# EAGLE design Ears 0603 (EAGLE 6.4)

## Sheet 1 of 3
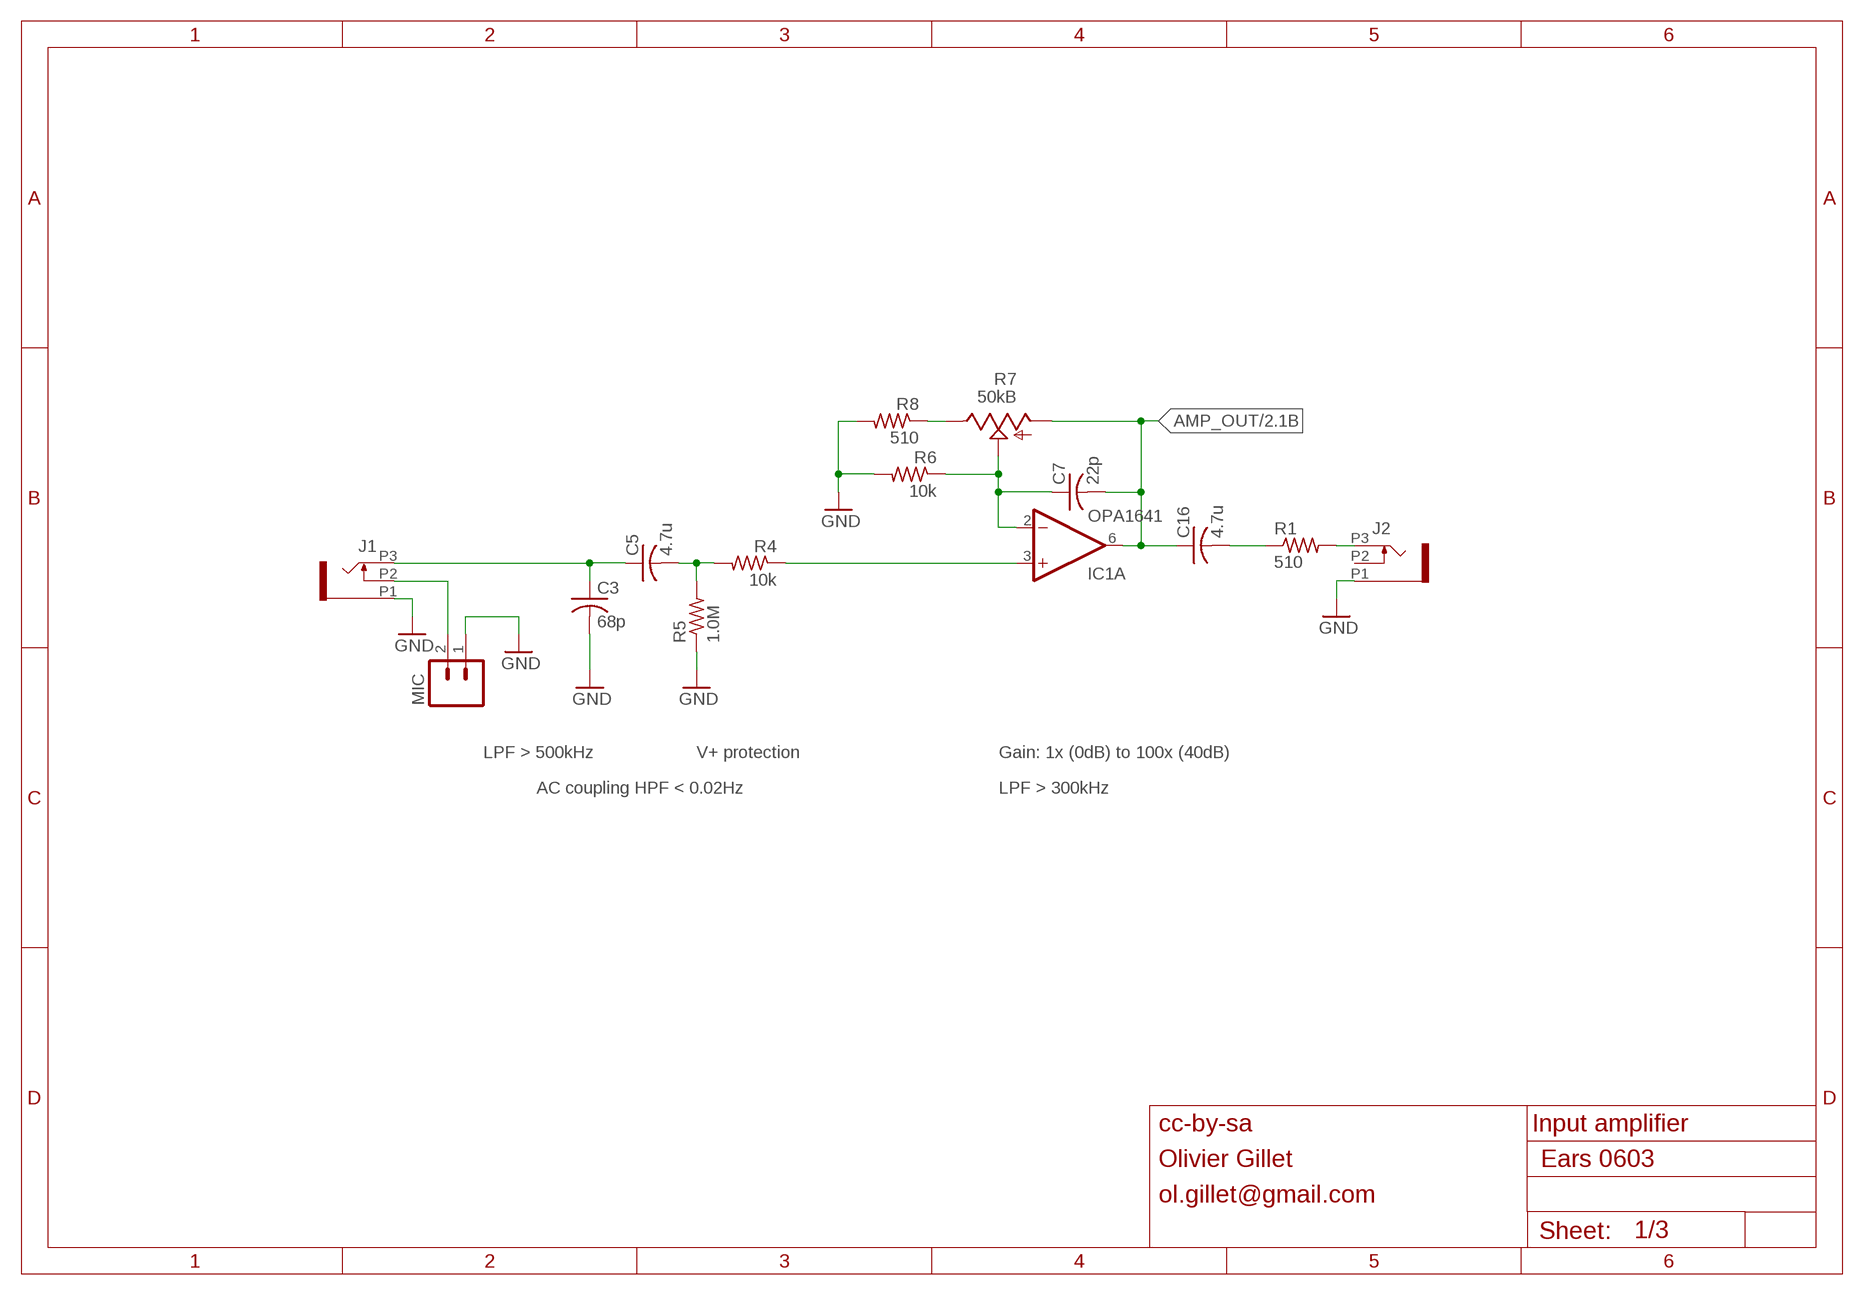
[diagram p0: schematic, sheet 1]

### Parts
C3  68p  C-USC0603  [C0603]
C5  4.7u  C-USC0603  [C0603]
C7  22p  C-USC0603  [C0603]
C16  4.7u  C-USC0603  [C0603]
IC1  OPA1641  [MSOP8]
J1  PJ301_THONKICONN6  [WQP_PJ_301M6]
J2  PJ301_THONKICONN6  [WQP_PJ_301M6]
MIC  M02TINY  [1X02_TINY]
R1  510  R-US_R0603  [R0603]
R4  10k  R-US_R0603  [R0603]
R5  1.0M  R-US_R0603  [R0603]
R6  10k  R-US_R0603  [R0603]
R7  50kB  POT_USVERTICAL_PS  [ALPS_POT_VERTICAL_PS]
R8  510  R-US_R0603  [R0603]

### Nets
AMP_OUT: C7.2 C16.1 IC1.6(A:OUT) R7.P$3(A) ; also sheet 2
GND: C3.2 J1.P1 J2.P1 MIC.1 R5.1 R6.2 R8.2 ; also sheet 2,3
N$2: IC1.3(A:+IN) R4.1
N$3: J2.P3 R1.2
N$4: C3.1 C5.1 J1.P3
N$7: J1.P2 MIC.2
N$9: C7.1 IC1.2(A:-IN) R6.1 R7.P$2(S)
N$10: C5.2 R4.2 R5.2
N$13: R7.P$1(E) R8.1
N$15: C16.2 R1.1
Unconnected: J2.P2

### Notes on the sheet
- LPF > 500kHz | V+ protection | Gain: 1x (0dB) to 100x (40dB)
- AC coupling HPF < 0.02Hz | LPF > 300kHz
- cc-by-sa | Input amplifier
- Olivier Gillet
- ol.gillet@gmail.com

## Sheet 2 of 3
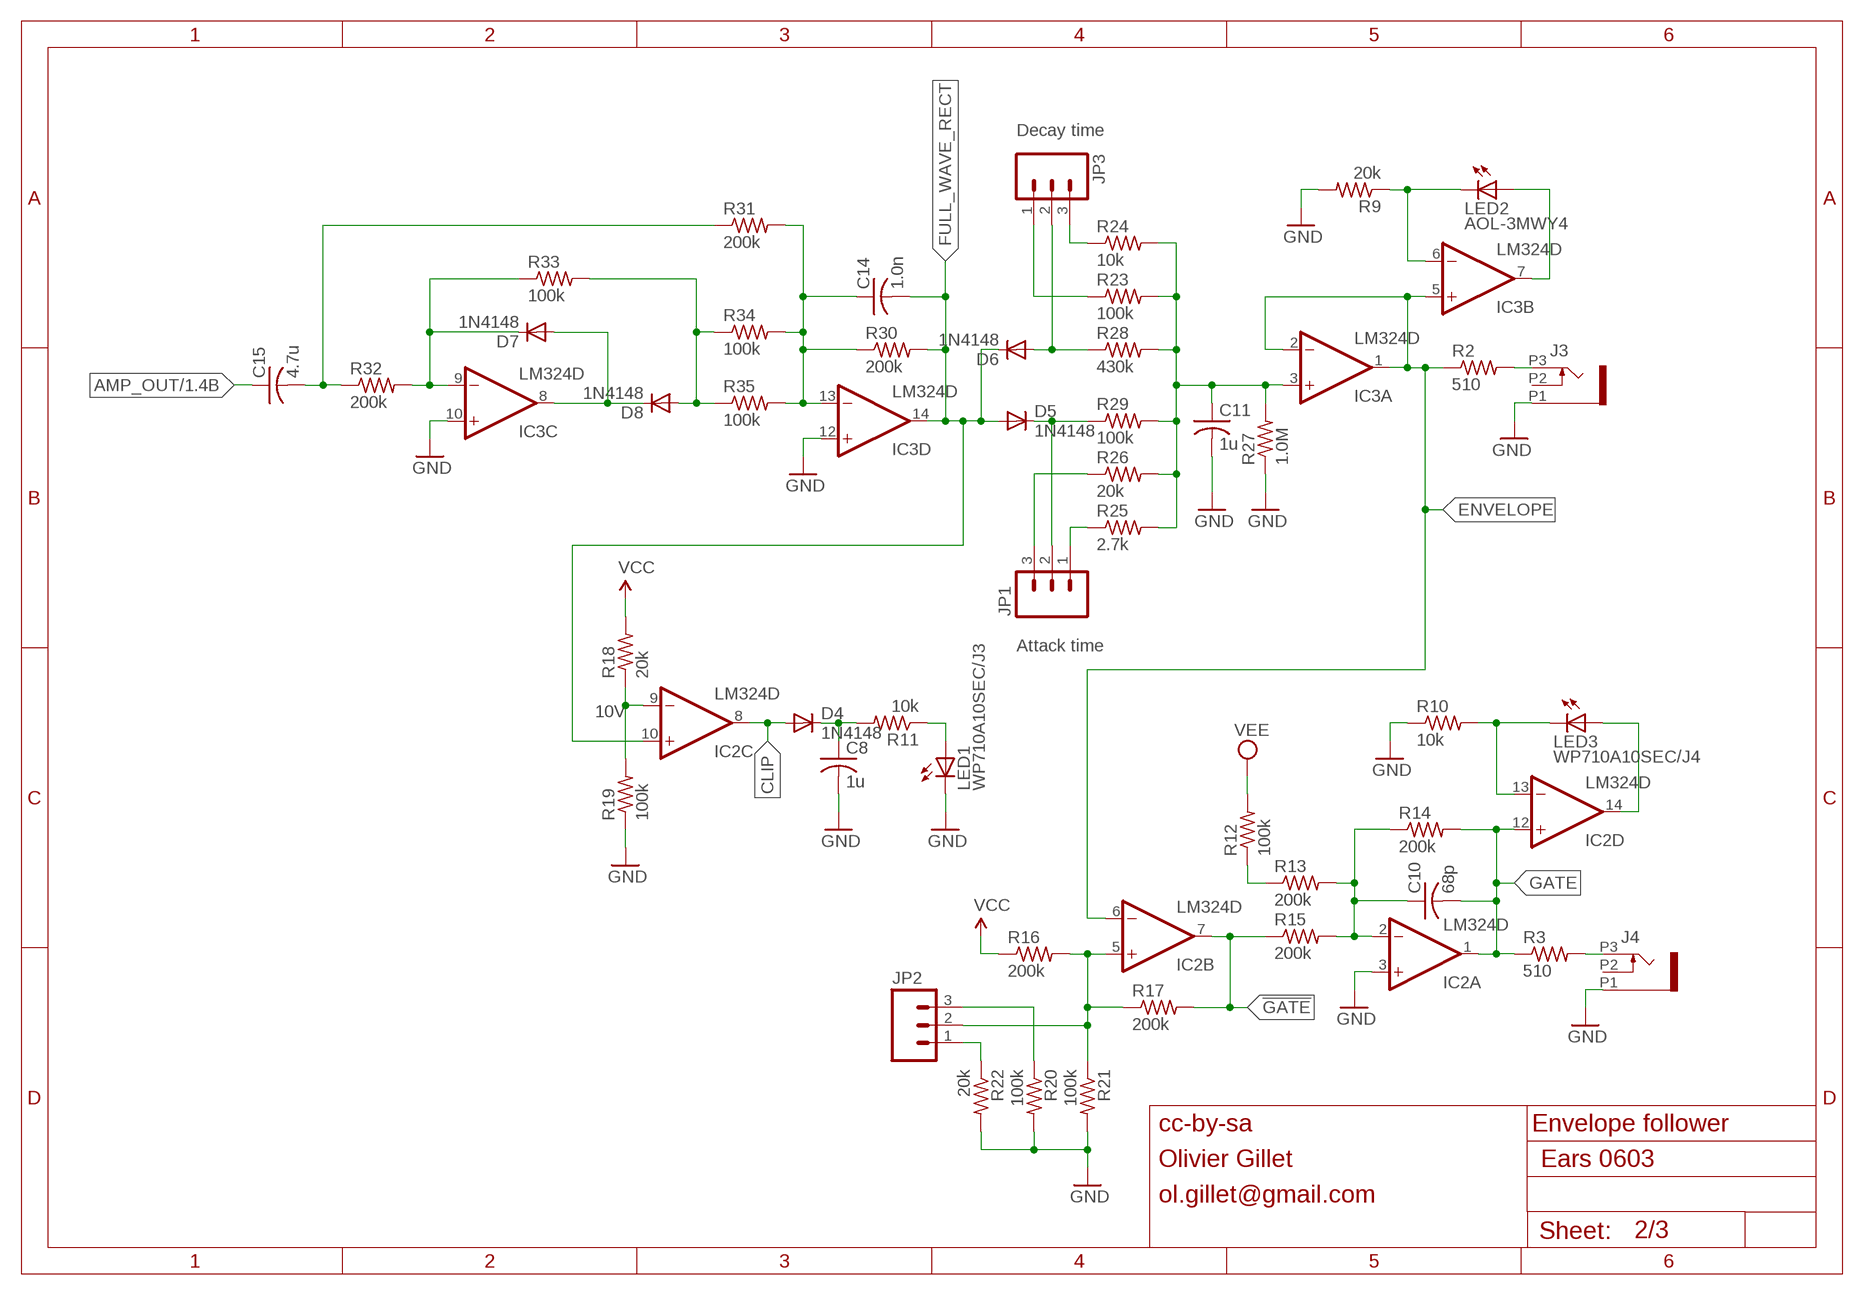
[diagram p1: schematic, sheet 2]

### Parts
C8  1u  C-USC0603  [C0603]
C10  68p  C-USC0603  [C0603]
C11  1u  C-USC0603  [C0603]
C14  1.0n  C-USC0603  [C0603]
C15  4.7u  C-USC0603  [C0603]
D4  1N4148  DIODE-SOD323-W  [SOD323-W]
D5  1N4148  DIODE-SOD323-W  [SOD323-W]
D6  1N4148  DIODE-SOD323-W  [SOD323-W]
D7  1N4148  DIODE-SOD323-W  [SOD323-W]
D8  1N4148  DIODE-SOD323-W  [SOD323-W]
IC2  LM324D  [SO14]
IC3  LM324D  [SO14]
J3  PJ301_THONKICONN6  [WQP_PJ_301M6]
J4  PJ301_THONKICONN6  [WQP_PJ_301M6]
JP1  M03PTH  [1X03]
JP2  M03PTH  [1X03]
JP3  M03PTH  [1X03]
LED1  WP710A10SEC/J3  LED3MM  [LED3MM]
LED2  AOL-3MWY4  LED3MM  [LED3MM]
LED3  WP710A10SEC/J4  LED3MM  [LED3MM]
R2  510  R-US_R0603  [R0603]
R3  510  R-US_R0603  [R0603]
R9  20k  R-US_R0603  [R0603]
R10  10k  R-US_R0603  [R0603]
R11  10k  R-US_R0603  [R0603]
R12  100k  R-US_R0603  [R0603]
R13  200k  R-US_R0603  [R0603]
R14  200k  R-US_R0603  [R0603]
R15  200k  R-US_R0603  [R0603]
R16  200k  R-US_R0603  [R0603]
R17  200k  R-US_R0603  [R0603]
R18  20k  R-US_R0603  [R0603]
R19  100k  R-US_R0603  [R0603]
R20  100k  R-US_R0603  [R0603]
R21  100k  R-US_R0603  [R0603]
R22  20k  R-US_R0603  [R0603]
R23  100k  R-US_R0603  [R0603]
R24  10k  R-US_R0603  [R0603]
R25  2.7k  R-US_R0603  [R0603]
R26  20k  R-US_R0603  [R0603]
R27  1.0M  R-US_R0603  [R0603]
R28  430k  R-US_R0603  [R0603]
R29  100k  R-US_R0603  [R0603]
R30  200k  R-US_R0603  [R0603]
R31  200k  R-US_R0603  [R0603]
R32  200k  R-US_R0603  [R0603]
R33  100k  R-US_R0603  [R0603]
R34  100k  R-US_R0603  [R0603]
R35  100k  R-US_R0603  [R0603]

### Nets
!GATE: IC2.7(B:OUT) R15.1 R17.2
AMP_OUT: C15.1 ; also sheet 1
AMP_OUT_AC: C15.2 R31.1 R32.1
CLIP: D4.A IC2.8(C:OUT)
ENVELOPE: IC2.6(B:-IN) IC3.1(A:OUT) IC3.2(A:-IN) IC3.5(B:+IN) R2.1
FULL_WAVE_RECT: C14.2 D5.A D6.C IC2.10(C:+IN) IC3.14(D:OUT) R30.2
GATE: C10.2 IC2.1(A:OUT) IC2.12(D:+IN) R3.1 R14.2
GND: C8.2 C11.2 IC2.3(A:+IN) IC3.10(C:+IN) IC3.12(D:+IN) J3.P1 J4.P1 LED1.K(C) R9.2 R10.1 R19.1 R20.2 R21.2 R22.2 R27.1 ; also sheet 1,3
N$5: D7.A D8.C IC3.8(C:OUT)
N$8: C10.1 IC2.2(A:-IN) R13.2 R14.1 R15.2
N$11: D7.C IC3.9(C:-IN) R32.2 R33.1
N$12: D8.A R33.2 R34.1 R35.1
N$14: C14.1 IC3.13(D:-IN) R30.1 R31.2 R34.2 R35.2
N$16: J3.P3 R2.2
N$17: IC3.6(B:-IN) LED2.K(C) R9.1
N$18: D5.C JP1.2 R29.1
N$19: C11.1 IC3.3(A:+IN) R23.2 R24.2 R25.2 R26.2 R27.2 R28.2 R29.2
N$21: JP3.3 R24.1
N$23: JP3.1 R23.1
N$24: D6.A JP3.2 R28.1
N$25: JP1.1 R25.1
N$26: JP1.3 R26.1
N$27: IC2.9(C:-IN) R18.1 R19.2
N$28: C8.1 D4.C R11.2
N$30: IC3.7(B:OUT) LED2.A
N$31: LED1.A R11.1
N$32: J4.P3 R3.2
N$33: IC2.5(B:+IN) JP2.2 R16.2 R17.1 R21.1
N$35: JP2.1 R22.1
N$36: JP2.3 R20.1
N$37: IC2.13(D:-IN) LED3.K(C) R10.2
N$38: IC2.14(D:OUT) LED3.A
N$39: R12.1 R13.1
VCC: R16.1 R18.2 ; also sheet 3
VEE: R12.2 ; also sheet 3
Unconnected: J3.P2 J4.P2

### Notes on the sheet
- Decay time
- Attack time
- 10V
- cc-by-sa | Envelope follower
- Olivier Gillet
- ol.gillet@gmail.com

## Sheet 3 of 3
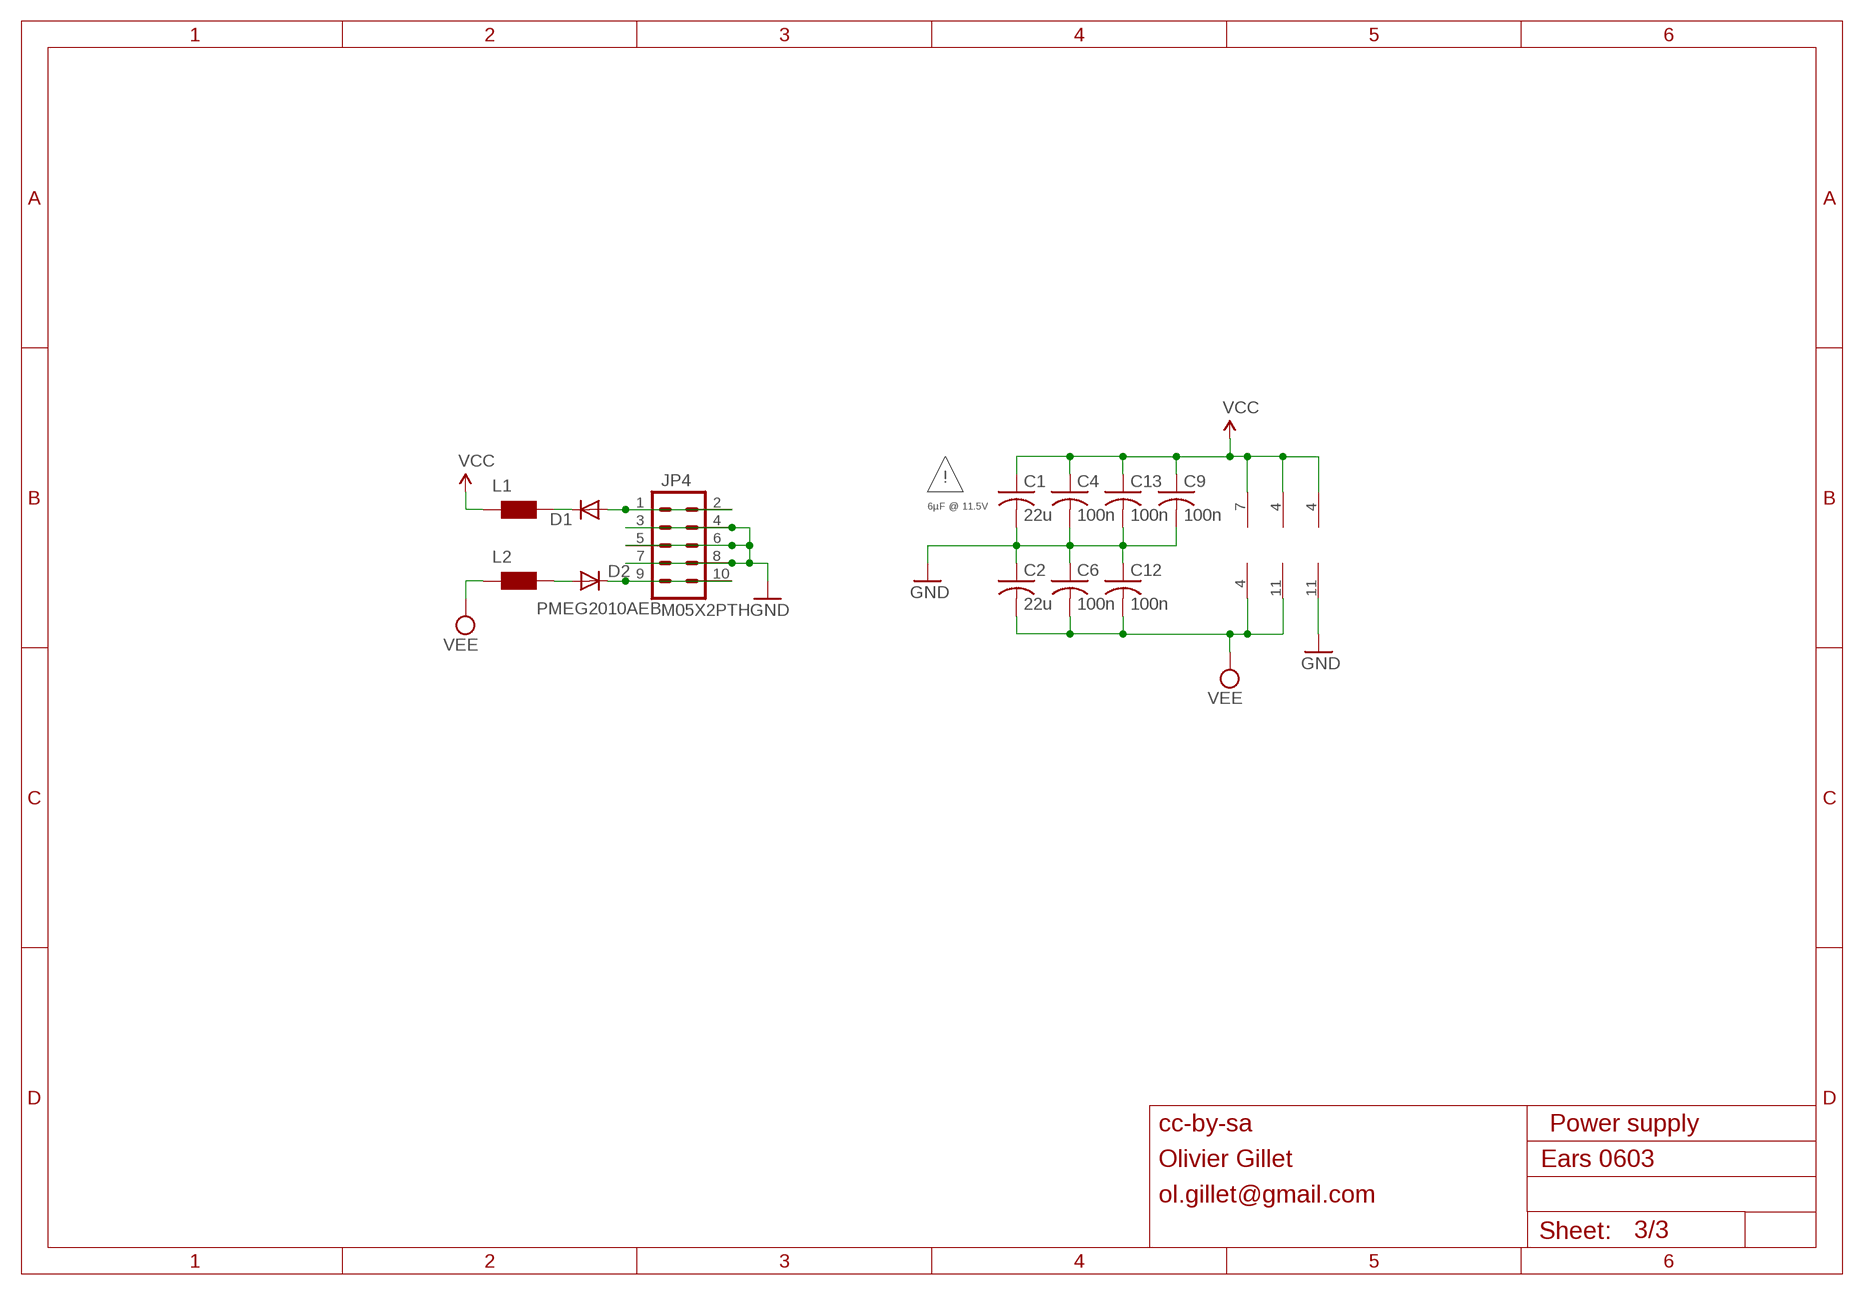
[diagram p2: schematic, sheet 3]

### Parts
C1  22u  C-USC1206  [C1206]
C2  22u  C-USC1206  [C1206]
C4  100n  C-USC0603  [C0603]
C6  100n  C-USC0603  [C0603]
C9  100n  C-USC0603  [C0603]
C12  100n  C-USC0603  [C0603]
C13  100n  C-USC0603  [C0603]
D1  PMEG2010AEB  DIODE-SOD323-W  [SOD323-W]
D2  PMEG2010AEB  DIODE-SOD323-W  [SOD323-W]
JP4  M05X2PTH  [AVR_ICSP]
L1  WE-CBF_0603  [0603]
L2  WE-CBF_0603  [0603]

### Nets
GND: C1.2 C2.1 C4.2 C6.1 C9.2 C12.1 C13.2 IC2.11(P:V-) JP4.3 JP4.4 JP4.5 JP4.6 JP4.7 JP4.8 ; also sheet 1,2
N$6: D1.A JP4.1 JP4.2
N$20: D2.C JP4.9 JP4.10
N$22: D1.C L1.2
N$44: D2.A L2.2
VCC: C1.1 C4.1 C9.1 C13.1 IC1.7(V+) IC2.4(P:V+) IC3.4(P:V+) L1.1 ; also sheet 2
VEE: C2.2 C6.2 C12.2 IC1.4(V-) IC3.11(P:V-) L2.1 ; also sheet 2

### Notes on the sheet
- !
- 6µF @ 11.5V
- cc-by-sa | Power supply
- Olivier Gillet
- ol.gillet@gmail.com

## Library data of the parts
C1-C16 = rcl:C-US: CAPACITOR, American symbol
D1 D2 D4-D8 = diode:DIODE-: DIODE
IC1 = og-ics:OPA1641
IC2 IC3 = og-ics:LM324: OP AMP
J1-J4 = og-pj301:PJ301_THONKICONN
JP1-JP3 = SparkFun:M03: Header 3 Standard 3-pin 0.1" header. Use with straight break away headers (SKU : PRT-00116), right angle break away headers (PRT-00553), swiss pins (PRT-00743), machine pins (PRT-00117), and female headers (PRT-00115). Molex polarized connector foot print use with SKU : PRT-08232 with associated crimp pins and housings.
JP4 = og-header:M05X2: Header 5x2 Standard 10-pin dual row 0.1" header. Commonly used with AVR-ISP. Use with Spark Fun Electronics SKU: PRT-00778
L1 L2 = wuerth-elektronik:WE-CBF: SMD EMI Suppression Ferrite Beads - excellent anti-EMI properties - low DCR - impedances till 3000 ohms - rated current up to 6 A
LED1-LED3 = led:LED: LED OSRAM: - CHIPLED LG R971, LG N971, LY N971, LG Q971, LY Q971, LO R971, LY R971 LH N974, LH R974 LS Q976, LO Q976, LY Q976 LO Q996 - Hyper CHIPLED LW Q18S LB Q993, LB Q99A, LB R99A - SideLED LS A670, LO A670, LY A670, LG A670, LP A670 LB A673, LV A673, LT A673, LW A673 LH A674 LY A675 LS A676, LA A676, LO A676, LY A676, LW A676 LS A679, LY A679, LG A679 - Hyper Micro SIDELED® LS Y876, LA Y876, LO Y876, LY Y876 LT Y87S - SmartLED LW L88C, LW L88S LB L89C, LB L89S, LG L890 LS L89K, LO L89K, LY L89K LS L896, LA L896, LO L896, LY L896 - TOPLED LS T670, LO T670, LY T670, LG T670, LP T670 LSG T670, LSP T670, LSY T670, LOP T670, LYG T670 LG T671, LOG T671, LSG T671 LB T673, LV T673, LT T673, LW T673 LH T674 LS T676, LA T676, LO T676, LY T676, LB T676, LH T676, LSB T676, LW T676 LB T67C, LV T67C, LT T67C, LS T67K, LO T67K, LY T67K, LW E67C LS E67B, LA E67B, LO E67B, LY E67B, LB E67C, LV E67C, LT E67C LW T67C LS T679, LY T679, LG T679 LS T770, LO T770, LY T770, LG T770, LP T770 LB T773, LV T773, LT T773, LW T773 LH T774 LS E675, LA E675, LY E675, LS T675 LS T776, LA T776, LO T776, LY T776, LB T776 LHGB T686 LT T68C, LB T68C - Hyper Mini TOPLED® LB M676 - Mini TOPLED Santana® LG M470 LS M47K, LO M47K, LY M47K Source: http://www.osram.convergy.de LUXEON: - LUMILED® LXK2-PW12-R00, LXK2-PW12-S00, LXK2-PW14-U00, LXK2-PW14-V00 LXK2-PM12-R00, LXK2-PM12-S00, LXK2-PM14-U00 LXK2-PE12-Q00, LXK2-PE12-R00, LXK2-PE12-S00, LXK2-PE14-T00, LXK2-PE14-U00 LXK2-PB12-K00, LXK2-PB12-L00, LXK2-PB12-M00, LXK2-PB14-N00, LXK2-PB14-P00, LXK2-PB14-Q00 LXK2-PR12-L00, LXK2-PR12-M00, LXK2-PR14-Q00, LXK2-PR14-R00 LXK2-PD12-Q00, LXK2-PD12-R00, LXK2-PD12-S00 LXK2-PH12-R00, LXK2-PH12-S00 LXK2-PL12-P00, LXK2-PL12-Q00, LXK2-PL12-R00 Source: www.luxeon.com KINGBRIGHT: KA-3528ASYC Source: www.kingbright.com
MIC = og-header:M02: Header 2 Standard 2-pin 0.1" header. Use with straight break away headers (SKU : PRT-00116), right angle break away headers (PRT-00553), swiss pins (PRT-00743), machine pins (PRT-00117), and female headers (PRT-00115). Molex polarized connector foot print use with SKU : PRT-08233 with associated crimp pins and housings.
R1-R6 R8-R35 = rcl:R-US_: RESISTOR, American symbol
R7 = og-pots:POT_US

## Board
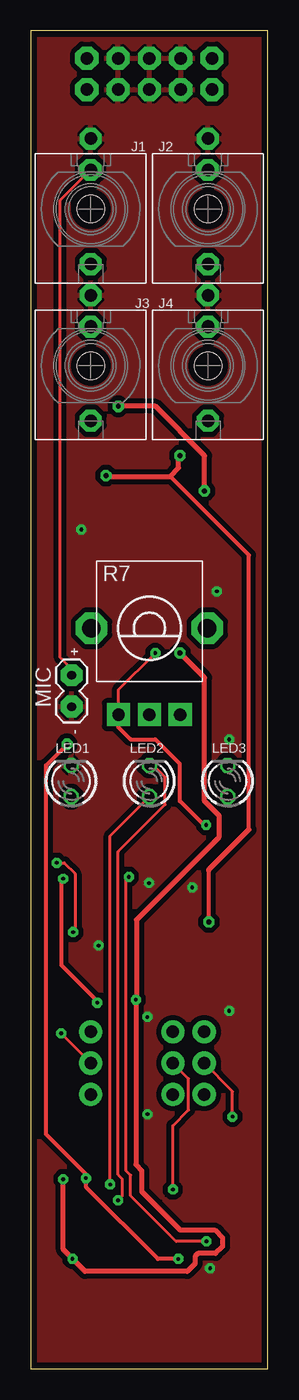
[diagram p3: board, top side]
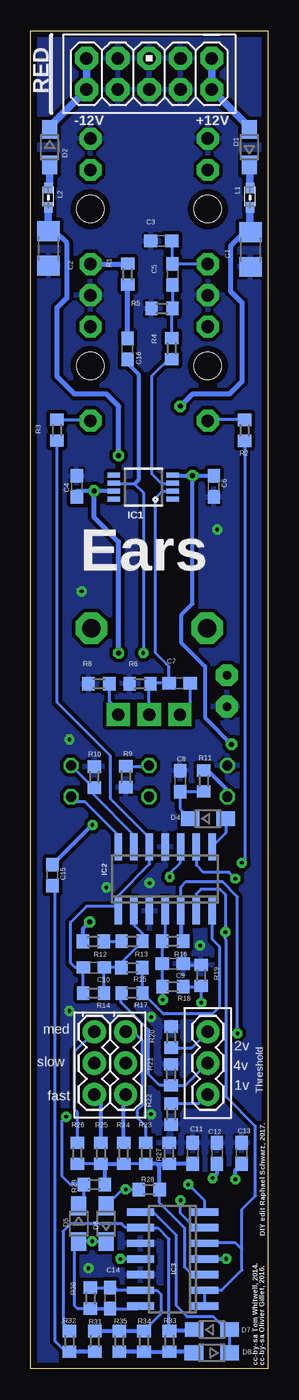
[diagram p4: board, bottom side, seen from below]

Size 19.23 x 108.43 mm. Coordinates in mm from the lower left corner, seen from the top.
Outline: 0,0 19.23,0 19.23,108.43 0,108.43 0,0
Copper layers (1*16): Top 0.035mm / dielectric 1.5mm / Bottom 0.035mm
Design rules "PCBCart-Standard *": minimum track width 8mil, minimum drill 0.4mm, track to track 8mil, track to pad 8mil, pad to pad 8mil, via to via 8mil, smd to smd 8mil, copper to edge 20mil, drill to drill 8mil, minimum pad ring 8mil, minimum via ring 10mil, stop-mask expansion 3mil, vias tented up to drill 25mil, thermal gap 8mil

### Footprints (pad centres in the part's own frame; a part is rotated, then mirrored left to right if it is on the bottom)
C1206 = smd 1.6 x 1.8: 1 -1.4,0; 2 1.4,0
C0603 = smd 1.1 x 1: 1 -0.85,0; 2 0.85,0
SOD323-W = smd 1.5 x 1.2: A 1.45,0; C -1.45,0
MSOP8 = smd 0.41 x 1.02: 1 -0.975,-2.4; 2 -0.325,-2.4; 3 0.325,-2.4; 4 0.975,-2.4; 5 0.975,2.4; 6 0.325,2.4; 7 -0.325,2.4; 8 -0.975,2.4
SO14 = smd 0.6 x 2.2: 1 -3.81,-2.6; 2 -2.54,-2.6; 3 -1.27,-2.6; 4 0,-2.6; 5 1.27,-2.6; 6 2.54,-2.6; 7 3.81,-2.6; 8 3.81,2.6; 9 2.54,2.6; 10 1.27,2.6; 11 0,2.6; 12 -1.27,2.6; 13 -2.54,2.6; 14 -3.81,2.6
WQP_PJ_301M6 = drill 1.016 pad 1.778 octagon: P1 0,-5.715; P2 0,-3.175; P3 0,4.445 | hole 2.2: 0,0
1X03 = drill 1.016 pad 1.88: 1 0,0; 2 2.54,0; 3 5.08,0
AVR_ICSP = drill 1.016 pad 1.88 octagon: 1 -1.27,5.08; 2 1.27,5.08; 3 -1.27,2.54; 4 1.27,2.54; 5 -1.27,0; 6 1.27,0; 7 -1.27,-2.54; 8 1.27,-2.54; 9 -1.27,-5.08; 10 1.27,-5.08
0603 = smd 0.85 x 0.7: 1 -0.9,0; 2 0.7,0
LED3MM = drill 0.813 octagon: A -1.27,0; K 1.27,0
1X02_TINY = drill 0.7 pad 1.778 octagon: 1 0,0; 2 2.54,0
R0603 = smd 1 x 1.1: 1 -0.85,0; 2 0.85,0
ALPS_POT_VERTICAL_PS = drill 1 pad 1.88 square: P$1 -2.5,7; P$2 0,7; P$3 2.5,7 | drill 1.5 pad 2.54 octagon: P$4 -4.7,0; P$5 4.7,0

### Placement (x,y rotation side)
C1  1.4,90.7 270 bottom
C2  17.8,90.8 90 bottom
C3  8.63,91.39 180 bottom
C4  15.5,71.5 90 bottom
C5  7.73,88.7 270 bottom
C6  4.37,71.5 90 bottom
C7  7.15,55.56 0 bottom
C8  7.11,47.62 90 bottom
C9  7.71,32.82 0 bottom
C10  14.13,32.52 180 bottom
C11  6.08,17.45 90 bottom
C12  4.13,17.45 270 bottom
C13  2.13,17.45 90 bottom
C14  12.8,5.71 270 bottom
C15  17.46,40.01 270 bottom
C16  11.38,82.64 90 bottom
D1  1.5,99 90 bottom
D2  17.7,99 270 bottom
D4  4.86,44.58 0 bottom
D5  15.34,11.75 270 bottom
D6  13.12,11.75 90 bottom
D7  4.53,3.17 0 bottom
D8  4.54,1.28 180 bottom
IC1  10.1,71.44 90 bottom
IC2  8.34,39.69 0 bottom
IC3  7.72,8.89 90 bottom
J1  4.86,93.98 180 top
J2  14.39,93.98 180 top
J3  4.86,81.28 180 top
J4  14.39,81.28 180 top
JP1  14.07,22.23 90 bottom
JP2  4.86,22.23 90 bottom
JP3  11.53,27.3 270 bottom
JP4  9.62,104.93 270 bottom
L1  1.45,95 90 bottom
L2  17.81,95 90 bottom
LED1  3.27,47.62 90 top
LED2  9.62,47.62 90 top
LED3  15.97,47.62 90 top
MIC  3.31,53.66 90 top
R1  11.38,88.71 90 bottom
R2  1.88,76.05 90 bottom
R3  17.09,76.07 90 bottom
R4  7.79,82.67 90 bottom
R5  8.58,85.92 0 bottom
R6  10.37,55.52 180 bottom
R7  9.62,60.01 180 top
R8  13.7,55.51 180 bottom
R9  11.51,47.97 270 bottom
R10  14.07,47.94 270 bottom
R11  5.19,47.62 270 bottom
R12  14.15,34.62 180 bottom
R13  11.01,34.63 0 bottom
R14  14.14,30.44 180 bottom
R15  11.02,32.51 180 bottom
R16  7.72,34.64 0 bottom
R17  11.01,30.45 0 bottom
R18  7.7,30.95 180 bottom
R19  5.41,31.87 270 bottom
R20  7.83,26.86 90 bottom
R21  7.86,23.81 90 bottom
R22  7.84,20.64 270 bottom
R23  9.88,17.45 270 bottom
R24  11.69,17.45 270 bottom
R25  13.53,17.45 270 bottom
R26  15.45,17.45 270 bottom
R27  8.01,17.45 270 bottom
R28  9.62,14.51 0 bottom
R29  14.07,14.92 0 bottom
R30  14.39,5.71 270 bottom
R31  14.03,2.21 90 bottom
R32  16.09,2.21 90 bottom
R33  7.98,2.21 270 bottom
R34  10.04,2.21 90 bottom
R35  12.04,2.21 90 bottom

### Tracks (layer width: path | path; a pad name or v marks a point on that pad's centre or on a via)
!GATE
  Bottom 0.254: R15.1 R17.2 8.45,28.74 4.5,28.74 3.91,29.33 3.91,34.21 4.5,34.8 4.5,37.07 IC2.7
AMP_OUT  (via drill 0.3)
  Top 0.254: v10.1,58 7.1,55 7.1,53.03 R7.P$3 7.12,52.02 7.1,52
  Top 0.305: v14.23,44.06 14.04,44.06 12.1,46 12.1,49 10.1,51 8.1,51 7.1,52
  Bottom 0.254: C7.2 6.3,53.83 R7.P$3 | IC1.6 12.44,71.71 10.81,71.71 10.1,71 v10.1,58 | C16.1 11.22,81.79
  Bottom 0.305: v14.23,44.06 14.26,44.06 C15.1 | 11.22,81.79 11.22,81.32 10.5,80.6 10.5,72.02 10.81,71.71
AMP_OUT_AC
  Bottom 0.254: C15.2 17.25,38.94 17.25,2.22 16.39,1.36 R32.1
  Bottom 0.305: R31.1 R32.1
CLIP
  Bottom 0.254: D4.A 3.41,43.41 IC2.8
ENVELOPE  (via drill 0.3)
  Top 0.254: v2.1,41 2.71,41 3.58,40.13 3.58,35.52 v3.44,35.38
  Bottom 0.254: IC3.1 IC3.2 3.75,6.35 2.1,8 2.1,9.66 | R2.1 1.88,41.23 v2.1,41 | 4.98,10.3 IC3.5 5.07,10.21 2.65,10.21 2.1,9.66 | IC2.6 5.8,38.48 5.43,38.85 3.87,38.85 3.44,38.42 v3.44,35.38 3.44,34.8 3.43,34.8 3.37,34.74 3.37,22.01 1,19.64 1,14 2.1,12.9 2.1,9.66
FULL_WAVE_RECT  (via drill 0.3)
  Top 0.254: v14.25,10.32 11.78,10.32 8.1,14 8.1,15.67 7.72,16.05 7.72,39.62 v7.96,39.86
  Bottom 0.254: C14.2 10.54,4.87 IC3.14 | R30.2 C14.2 | C14.2 15.44,4.87 15.66,5.08 15.66,9.98 D5.A 15.32,10.32 v14.25,10.32 14.23,10.3 D6.C | v7.96,39.86 7.96,40.14 7.1,41 7.1,42.26 IC2.10
GATE
  Bottom 0.254: 12.16,37.11 12.16,37.47 | 12.16,37.94 12.16,38.33 9.59,40.9 9.59,42.28 IC2.12 9.63,42.32 9.63,43.07 12.79,46.23 12.79,49.69 17.1,54 R3.1 17.09,75 | 14.99,32.51 C10.2 | 12.16,37.11 IC2.1 | 12.16,37.47 14.71,37.47 16,36.17 16,32.9 15.62,32.52 C10.2 | 12.16,37.47 12.16,37.94 | 12.16,37.94 12.1,38 12.1,37 12.16,37.06 12.16,37.11 | R14.2 15,32.5 C10.2
GND  (via drill 0.3)
  Bottom 0.254: C9.2 6.76,32.73 R19.1 | R10.1 14.07,48.97
  other vias: 14.55,8.13 5.5,34.29 9.6,39.35 9.46,28.5 9.48,20.62 16.1,51 4.1,68 15.1,63 13.1,39 16.1,29
  pour Bottom (isolate 0.305): 0,108.43 0,0 19.23,0 19.23,108.43
  pour Top (isolate 0.406): 0,108.43 0,0 19.23,0 19.23,108.43
N$2
  Bottom 0.254: R4.1 7.79,82.08 9.42,80.45 9.42,72.56 8.57,71.71 7.76,71.71 IC1.3
N$3
  Bottom 0.406: J2.P3 11.38,89.53 R1.2
N$4
  Bottom 0.254: J1.P3 7.72,89.53 C5.1 7.73,91.34 C3.1
N$5
  Bottom 0.254: IC3.8 9.31,12.7 7.4,10.79 7.4,5.08 6.52,4.2 4.4,4.2 3.37,3.17 D7.A D8.C
N$6
  Bottom 0.61: JP4.1 JP4.2 1.5,100.62 D1.A
N$7
  Top 0.254: J1.P2 2.39,94.68 2.39,57.63 3.31,56.71 MIC.2
N$8
  Bottom 0.254: R14.1 13.29,32.51 C10.1 13.27,32.51 R15.2 11.87,32.92 R13.2 10.16,35.26 10.9,36 10.9,37.07 IC2.2
N$9
  Bottom 0.254: R7.P$2 9.62,55.41 R6.1 9.47,55.56 C7.1 8,56.9 9.1,58 9.1,70.57 8.54,71.13 IC1.2
N$10
  Bottom 0.254: C5.2 R5.2 7.79,85.86 R4.2
N$11
  Bottom 0.254: IC3.9 11.53,11.43 11.85,11.75 15.97,11.75 16.61,11.11 16.61,3.71 16.09,3.18 R32.2 | 10.29,11.4 8.9,11.4 8,10.5 8,3.08 R33.1
  Bottom 0.305: 10.29,11.4 IC3.9 | D7.C 6.08,3.06 R33.1
N$12
  Bottom 0.305: R35.1 R34.1 R33.2 6.08,1.36 D8.A
N$13
  Bottom 0.254: R7.P$1 12.12,53.34 12.85,54.07 R8.1
N$14
  Bottom 0.254: R30.1 C14.1 12.37,6.57 12.15,6.35 IC3.13 8.99,6.35 8.67,6.03 8.67,4.45 10.04,3.07 R34.2
  Bottom 0.305: R31.2 R35.2 R34.2
N$15
  Bottom 0.406: C16.2 R1.1
N$16
  Bottom 0.254: R2.2 4.79,76.9 J3.P3
N$17  (via drill 0.3)
  Top 0.254: LED2.K 9.94,48.9 10.89,47.94 10.89,45.72 7.08,41.91 7.08,15.71 7.4,15.4 7.4,13.97 v7.08,13.64
  Bottom 0.254: R9.1 9.7,48.82 LED2.K | v7.08,13.64 7.1,13.62 7.1,12.6 5.92,11.41 5.92,11.4 5.15,11.4 IC3.6
N$18  (via drill 0.3)
  Top 0.254: v16.37,20.42 16.37,22.47 JP1.2
  Bottom 0.254: R29.1 14.92,13.62 D5.C | 15.08,15.08 15.08,14.9 14.94,14.9 R29.1 | R29.1 16.02,14.92 16.7,15.6 16.7,20.09 v16.37,20.42
N$19
  Bottom 0.254: R28.2 8.78,13.44 6.77,11.43 6.77,8.26 6.13,7.62 IC3.3 | R23.2 R24.2 | R25.2 R26.2
  Bottom 0.305: C11.1 R27.2 9,16.6 | 9,16.6 R23.2 | R24.2 R25.2 13.22,16.29 R29.2 | R28.2 8.78,16.38 9,16.6
N$20
  Bottom 0.61: JP4.9 JP4.10 17.7,100.67 D2.C
N$21
  Bottom 0.305: R24.1 11.69,22.06 JP3.3
N$22
  Bottom 0.61: L1.2 1.45,97.5 D1.C
N$23
  Bottom 0.254: JP3.1 10.9,27.3 10.18,26.58 10.18,21.35 10.58,20.95 10.58,20.32 9.88,19.63 R23.1
N$24  (via drill 0.3)
  Top 0.254: v11.53,14.52 11.53,19.68 12.8,20.95 12.8,23.5 JP3.2
  Bottom 0.254: D6.A 11.8,14.52 v11.53,14.52 11.52,14.51 R28.1
N$25
  Bottom 0.305: R25.1 13.53,21.68 JP1.1
N$26
  Bottom 0.254: 15.66,21 15.66,20.95 | 15.66,21 15.66,25.72 JP1.3 | R26.1 15.45,20.79 15.66,21
N$27  (via drill 0.3)
  Top 0.305: v5.4,29.66 5.4,29.8 2.5,32.7 2.5,39.58 v2.63,39.71
  Bottom 0.254: v2.63,39.71 v2.63,39.72 3.14,40.23 5.22,40.23 5.8,40.81 5.79,40.81 IC2.9 | v5.4,29.66 5.4,31.01 R19.2 5.47,30.95 R18.1
N$28
  Bottom 0.254: R11.2 C8.1 7.11,45.37 D4.C
N$30  (via drill 0.3)
  Top 0.254: v6.45,14.92 6.45,43.18 LED2.A
  Bottom 0.254: IC3.7 5.12,13.59 v6.45,14.92
N$31
  Bottom 0.305: R11.1 4.87,48.48 3.29,46.9 3.29,46.37 LED1.A
N$32
  Bottom 0.254: R3.2 14.47,76.92 J4.P3
N$33  (via drill 0.3)
  Top 0.254: JP2.2 v2.46,27.16
  Bottom 0.254: JP2.2 6.67,22.96 R21.1 8.78,22.96 9.67,23.86 9.67,27.47 11.9,29.7 11.9,30.41 R17.1 | IC2.5 7.07,39.03 6.63,39.47 3.69,39.47 2.46,38.23 v2.46,27.16
  Bottom 0.305: IC2.5 7.07,34.84 R16.2 | 11.9,30.41 R17.1
N$35
  Bottom 0.254: R22.1 5.6,21.49 JP2.1
N$36
  Bottom 0.254: R20.1 6.16,26.01 JP2.3
N$37
  Bottom 0.254: 14.07,47.2 R10.2 | LED3.K 14.17,47.09 R10.2 | IC2.13 10.88,43.27 14.1,46.5 14.1,47.06 R10.2
N$38
  Bottom 0.254: IC2.14 12.14,43.24 14.83,45.93 15.55,45.93 LED3.A
N$39
  Bottom 0.254: R12.1 11.87,34.62 R13.1
N$44
  Bottom 0.61: D2.A 17.7,95.81 L2.2
VCC  (via drill 0.3, 0.4)
  Top 0.305: 8.56,29.94 v8.52,29.9
  Top 0.406: v8.52,29.9 8.52,16.53 9,16.05 9,14.36 12.12,11.24 14.93,11.24 15.55,10.62 15.55,9.89 15,9.34 13.57,9.34 13.33,9.1 13.33,8.51 12.71,7.89 4.39,7.89 v3.38,8.91 2.62,9.66 v2.62,15.35 | 8.56,29.94 8.56,36.37 8.57,36.37 15.3,43.1 15.3,44.8 14.1,46 14.1,56 v12.1,58 | v14.1,71.14 14.1,74 10.1,78 v7.1,78
  Bottom 0.254: v8.52,29.9 8.55,29.93 R18.2 C9.1 R16.1 8.34,34.88 IC2.4
  Bottom 0.305: IC1.7 14.1,71.12 | 14.1,71.12 15.5,71.12 C4.1 | v14.1,71.14 14.1,71.12 | IC3.4 5.1,8.91 v3.38,8.91 | v2.62,15.35 2.62,16.11 C13.1
  Bottom 0.406: v7.1,78 6.1,79 3.1,79 2.1,80 2.1,86.4 3,87.3 3,91 1.9,92.1 C1.1 | v12.1,58 12.1,67 14.1,69 v14.1,71.14
  Bottom 0.61: L1.1 1.45,92.15 C1.1
VEE  (via drill 0.3, 0.4)
  Top 0.305: v6.1,72.38 6.16,72.32 | v14.45,36.21 14.45,40.35 | v2.94,50.6 1.24,48.9 1.24,19 4.47,15.77 v4.47,15.44 4.5,15.41 4.5,14.7 IC3.11 v11.96,8.89 | 11.32,72.32 17.7,65.94 17.7,43.7
  Top 0.406: v12.1,74 12,73.9 12,73 11.32,72.32 6.16,72.32 | 14.45,40.35 14.45,40.45 17.7,43.7
  Bottom 0.254: IC3.11 v11.96,8.89
  Bottom 0.305: C6.2 6.1,72.35 | 6.1,72.35 7.7,72.35 IC1.4 | 6.1,72.35 v6.1,72.38 6.1,62 6.99,61.11 6.99,58.81 5.1,56.92 5.1,52.76 v2.94,50.6 | R12.2 15,35.66 v14.45,36.21 | C12.2 4.13,15.78 v4.47,15.44
  Bottom 0.406: v12.1,74 12.1,78 13.1,79 15.69,79 17.1,80.41 17.1,86 16.3,86.8 16.3,91.2 17.3,92.2 C2.2
  Bottom 0.61: L2.1 C2.2

### Text on the board
tPlace: + | -
bPlace: RED | med | 2v | 4v | slow | 1v | fast | Threshold
bNames: +12V | -12V | Ears | DIY edit Raphael Schwarz, 2017. | cc-by-sa Olivier Gillet, 2016. | cc-by-sa Tom Whitwell, 2014.